# EAGLE design vco-8038 (EAGLE 7.6.0)
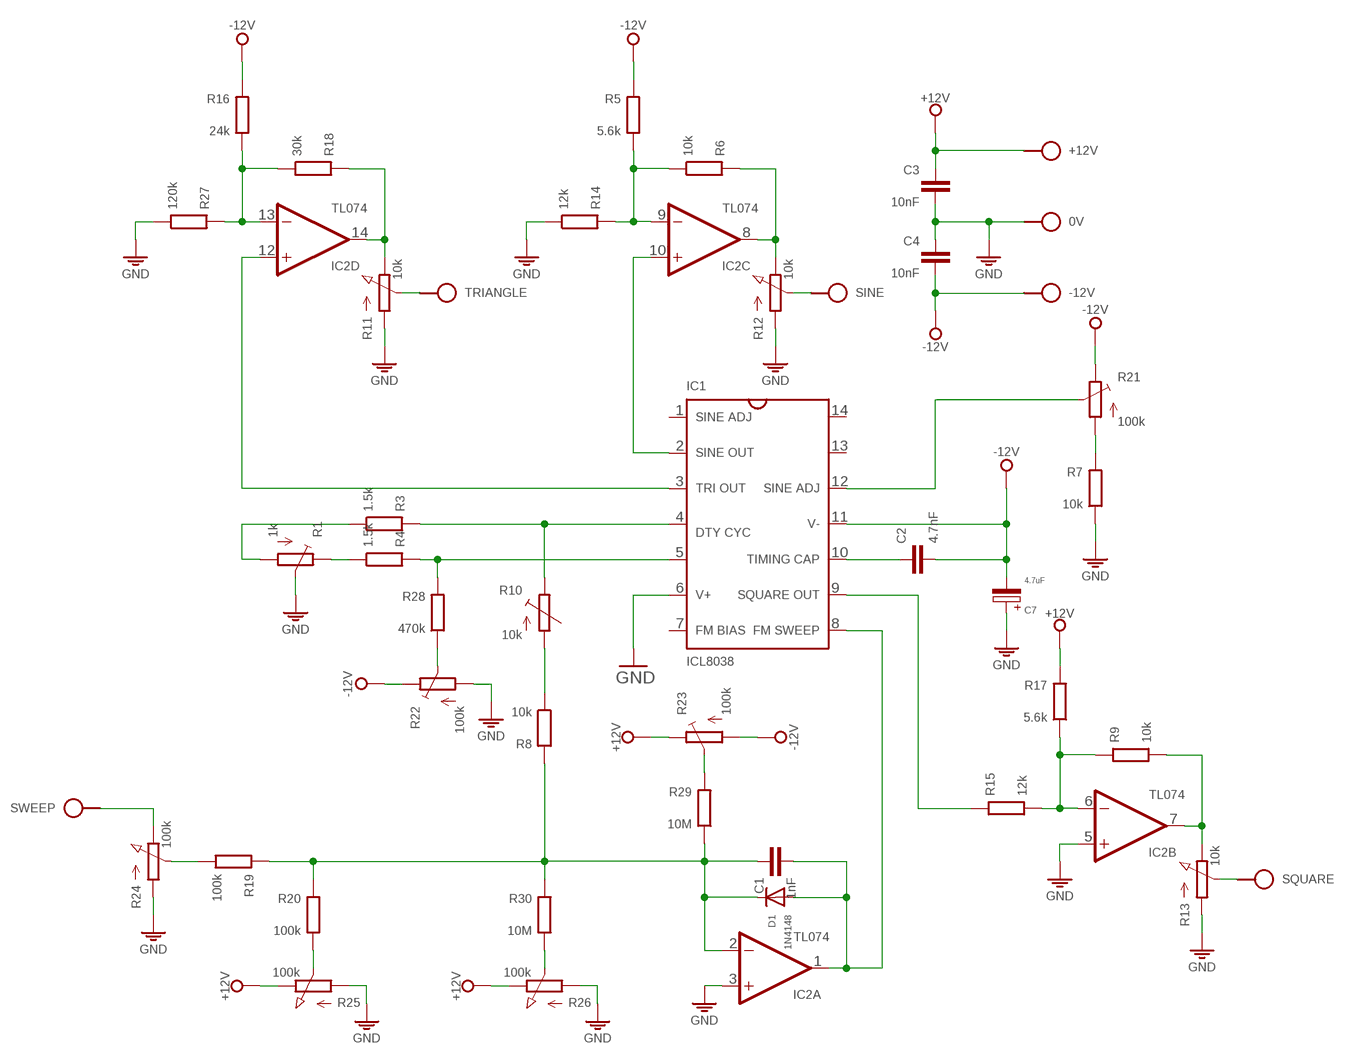
[diagram p0: schematic, sheet 1]

## Parts
0V  SPAD  [SPAD]
+12V  SPAD  [SPAD]
-12V  SPAD  [SPAD]
C1  1nF  C050-020X036  [C050-020X036]
C2  4.7nF  C050-020X036  [C050-020X036]
C3  10nF  C050-020X036  [C050-020X036]
C4  10nF  C050-020X036  [C050-020X036]
C7  4.7uF  CPOLE5-5/V  [E5-5/V]
D1  1N4148  1N414834-7  [DO34-7]
IC1  ICL8038  [DIL14]
IC2  TL074  TL074P  [DIL14]
R1  1k  TRIMR-TRIM  [R-TRIM]
R3  1.5k  R0204/7  [0204/7]
R4  1.5k  R0204/7  [0204/7]
R5  5.6k  R0204/7  [0204/7]
R6  10k  R0204/7  [0204/7]
R7  10k  R0204/7  [0204/7]
R8  10k  R0204/7  [0204/7]
R9  10k  R0204/7  [0204/7]
R10  10k  TRIM-2R-TRIM-2  [R-TRIM]
R11  10k  POT  [POT]
R12  10k  POT  [POT]
R13  10k  POT  [POT]
R14  12k  R0204/7  [0204/7]
R15  12k  R0204/7  [0204/7]
R16  24k  R0204/7  [0204/7]
R17  5.6k  R0204/7  [0204/7]
R18  30k  R0204/7  [0204/7]
R19  100k  R0204/7  [0204/7]
R20  100k  R0204/7  [0204/7]
R21  100k  TRIMR-TRIM  [R-TRIM]
R22  100k  TRIMR-TRIM  [R-TRIM]
R23  100k  TRIMR-TRIM  [R-TRIM]
R24  100k  POT  [POT]
R25  100k  POT  [POT]
R26  100k  POT  [POT]
R27  120k  R0204/7  [0204/7]
R28  470k  R0204/7  [0204/7]
R29  10M  R0204/7  [0204/7]
R30  10M  R0204/7  [0204/7]
SINE  SPAD  [SPAD]
SQUARE  SPAD  [SPAD]
SWEEP  SPAD  [SPAD]
TRIANGLE  SPAD  [SPAD]

## Nets
GND: 0V.1 C3.2 C4.1 C7.+ IC1.6(V+) IC2.3(A:+IN) IC2.5(B:+IN) R1.2(S) R7.1 R11.1(A) R12.1(A) R13.1(A) R14.1 R22.1(A) R24.1(A) R25.1(A) R26.1(A) R27.1
LF_SYMM: R22.2(S) R28.1
N$1: R23.2(S) R29.2
N$2: C1.2 D1.A IC1.8(FM_SWEEP) IC2.1(A:OUT)
N$3: C1.1 D1.C IC2.2(A:-IN) R8.2 R19.2 R20.2 R29.1 R30.2
N$4: R26.2(S) R30.1
N$5: R20.1 R25.2(S)
N$6: R19.1 R24.2(S)
N$7: R24.3(E) SWEEP.1
N$8: R8.1 R10.3
N$10: R1.1(A) R3.1
N$11: R1.3(E) R4.1
N$12: IC1.4(DUTY_1) R3.2 R10.1 R10.2
N$13: IC2.13(D:-IN) R16.1 R18.1 R27.2
N$14: IC1.5(DUTY_2) R4.2 R28.2
N$15: IC2.14(D:OUT) R11.3(E) R18.2
N$16: R11.2(S) TRIANGLE.1
N$17: IC1.3(TRI_OUT) IC2.12(D:+IN)
N$18: IC2.9(C:-IN) R5.1 R6.1 R14.2
N$19: IC2.8(C:OUT) R6.2 R12.3(E)
N$20: R12.2(S) SINE.1
N$21: IC1.2(SINE_OUT) IC2.10(C:+IN)
N$22: R7.2 R21.1(A)
N$23: IC1.12(SINE_ADJ_2) R21.2(S)
N$24: C2.1 IC1.10(TIMING_CAP)
N$25: IC2.6(B:-IN) R9.2 R15.1 R17.1
N$26: IC2.7(B:OUT) R9.1 R13.3(E)
N$27: R13.2(S) SQUARE.1
N$29: IC1.9(SQR_OUT) R15.2
V+: +12V.1 C3.1 R17.2 R23.3(E) R25.3(E) R26.3(E) ; supply symbol labelled +12V
V-: -12V.1 C2.2 C4.2 C7.- IC1.11(V-) R5.2 R16.2 R21.3(E) R22.3(E) R23.1(A) ; supply symbol labelled -12V
Unconnected: IC1.1(SINE_ADJ) IC1.7(FM_BIAS) IC1.13(NC_1) IC1.14(NC_2)

## Power pins joined to a net without a drawn wire
V+: IC2.4(P:V+)
V-: IC2.11(P:V-)

## Library data of the parts
0V +12V -12V SINE SQUARE SWEEP TRIANGLE = pad:SPAD
C1-C4 = c:C: CAPACITOR, European symbol
C7 = c:CPOL: POLARIZED CAPACITOR, European symbol
D1 = d:1N4148
IC1 = ic:ICL8038
IC2 = ic:TL074: OP AMP
R1 R21-R23 = r:TRIM: POTENTIOMETER
R3-R9 R14-R20 R27-R30 = r:R: RESISTOR, European symbol
R10 = r:TRIM-2
R11-R13 R24-R26 = r:POT

## Board
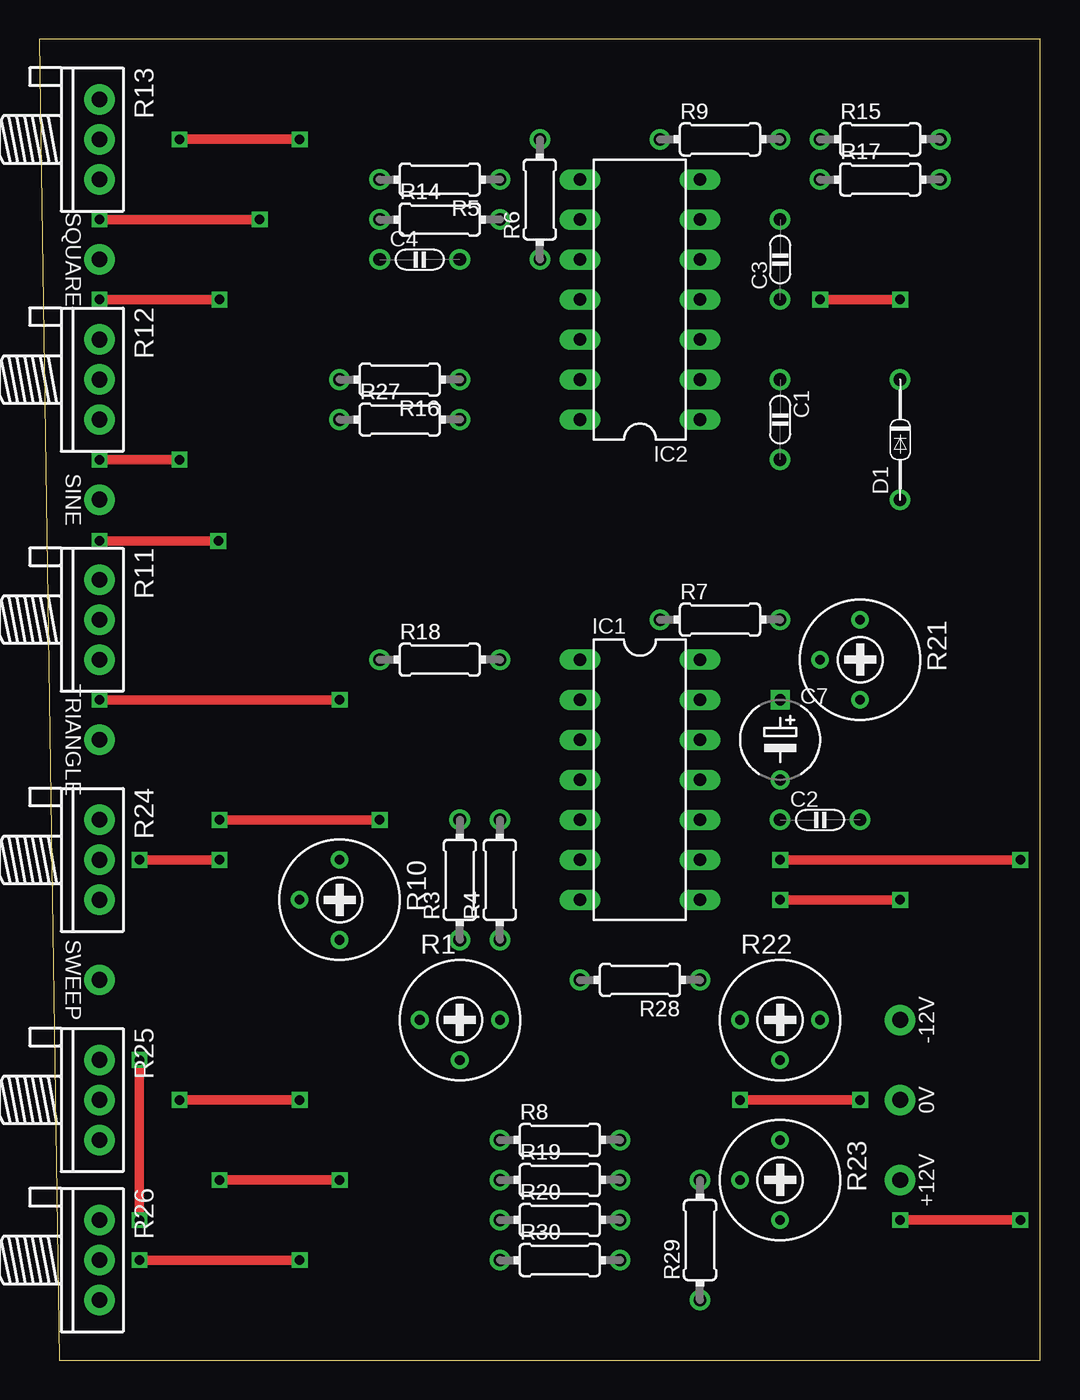
[diagram p1: board, top side]
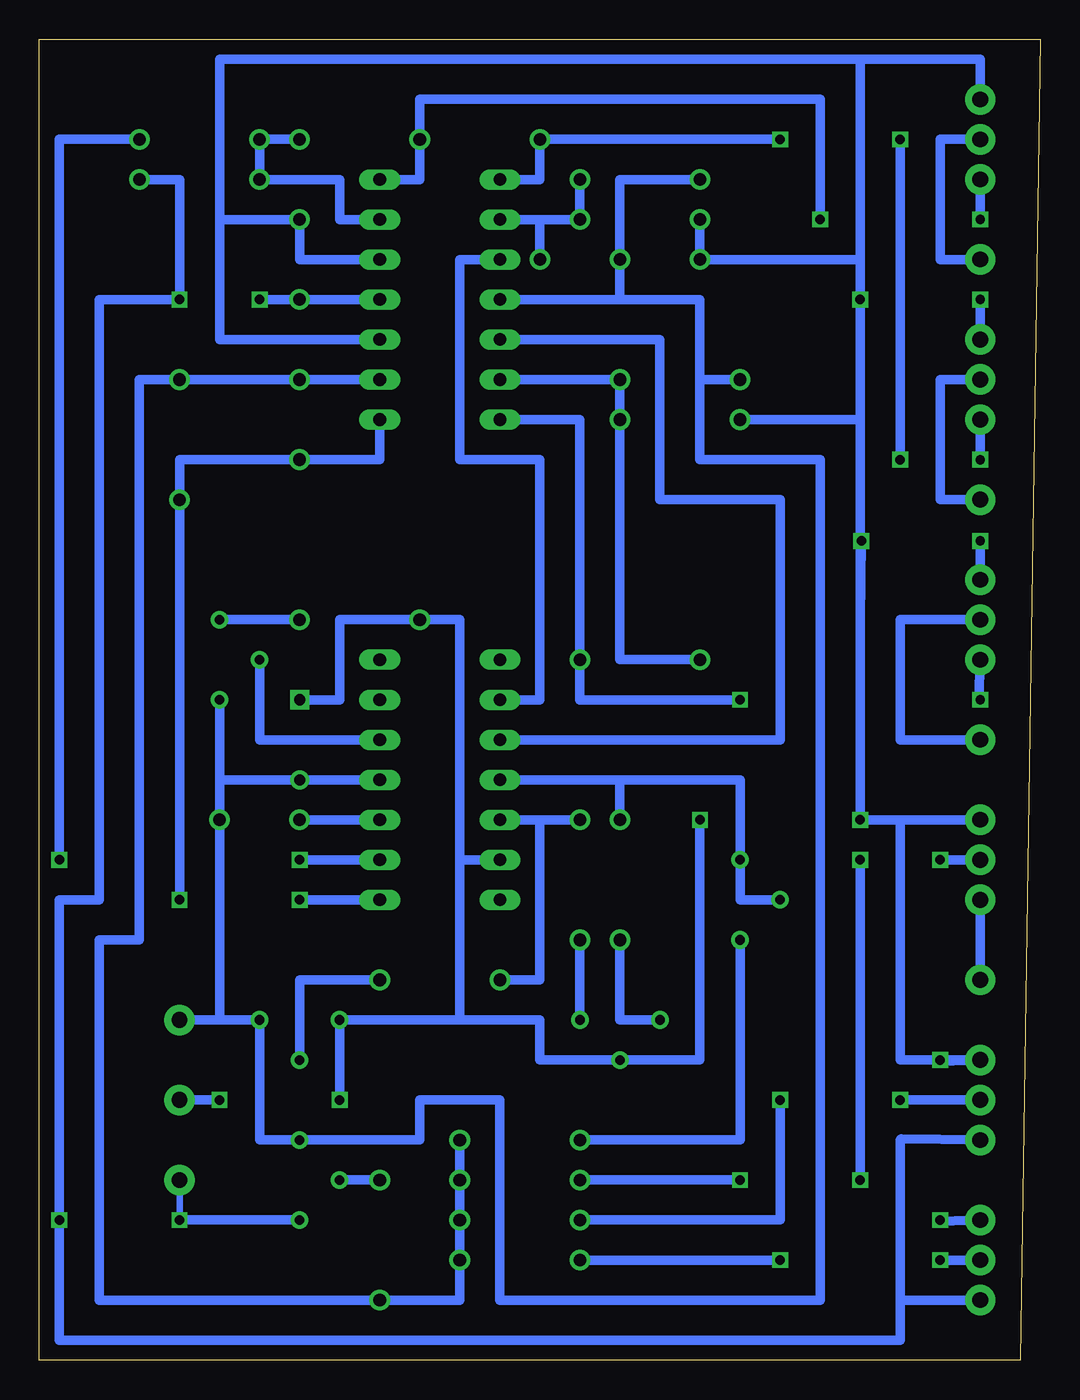
[diagram p2: board, bottom side, seen from below]

Size 63.5 x 83.82 mm. Coordinates in mm from the lower left corner, seen from the top.
Outline: 1.27,0 63.5,0 63.5,83.82 0,83.82 1.27,0
Copper layers (1*16): Top 0.035mm / dielectric 1.5mm / Bottom 0.035mm
Design rules "default": minimum track width 10mil, minimum drill 24mil, track to track 8mil, track to pad 8mil, pad to pad 8mil, via to via 8mil, smd to smd 8mil, copper to edge 40mil, drill to drill 8mil, minimum pad ring 10mil, minimum via ring 8mil, stop-mask expansion 4mil, vias tented up to drill 0mil, thermal gap 10mil

### Footprints (pad centres in the part's own frame; a part is rotated, then mirrored left to right if it is on the bottom)
SPAD = drill 1 pad 1.93: 1 0,0
C050-020X036 = drill 0.8: 1 0,-2.54; 2 0,2.54
E5-5/V = drill 0.7 square: + 0,2.54 | drill 0.7: - 0,-2.54
DO34-7 = drill 0.8: A 3.81,0; C -3.81,0
DIL14 = drill 0.8 long: 1 -3.81,7.62; 2 -3.81,5.08; 3 -3.81,2.54; 4 -3.81,0; 5 -3.81,-2.54; 6 -3.81,-5.08; 7 -3.81,-7.62; 8 3.81,-7.62; 9 3.81,-5.08; 10 3.81,-2.54; 11 3.81,0; 12 3.81,2.54; 13 3.81,5.08; 14 3.81,7.62
R-TRIM = drill 0.61: 1 -2.54,0; 2 0,-2.54; 3 2.54,0
0204/7 = drill 0.8: 1 -3.81,0; 2 3.81,0
POT = drill 1 pad 1.93: 1 -2.54,0; 2 0,0; 3 2.54,0

### Placement (x,y rotation side)
0V  54.61,16.51 180 top
+12V  54.61,11.43 180 top
-12V  54.61,21.59 180 top
C1  46.99,59.69 180 top
C2  49.53,34.29 270 top
C3  46.99,69.85 0 top
C4  24.13,69.85 270 top
C7  46.99,39.37 0 top
D1  54.61,58.42 270 top
IC1  38.1,36.83 0 top
IC2  38.1,67.31 180 top
R1  26.67,21.59 0 top
R3  26.67,30.48 90 top
R4  29.21,30.48 90 top
R5  25.4,74.93 180 top
R6  31.75,73.66 90 top
R7  43.18,46.99 0 top
R8  33.02,13.97 0 top
R9  43.18,77.47 0 top
R10  19.05,29.21 270 top
R11  3.81,46.99 270 top
R12  3.81,62.23 270 top
R13  3.81,77.47 270 top
R14  25.4,72.39 0 top
R15  53.34,77.47 0 top
R16  22.86,62.23 180 top
R17  53.34,74.93 0 top
R18  25.4,44.45 0 top
R19  33.02,11.43 0 top
R20  33.02,8.89 0 top
R21  52.07,44.45 270 top
R22  46.99,21.59 0 top
R23  46.99,11.43 270 top
R24  3.81,31.75 270 top
R25  3.81,16.51 270 top
R26  3.81,6.35 270 top
R27  22.86,59.69 0 top
R28  38.1,24.13 180 top
R29  41.91,7.62 90 top
R30  33.02,6.35 0 top
SINE  3.81,54.61 0 top
SQUARE  3.81,69.85 0 top
SWEEP  3.81,24.13 0 top
TRIANGLE  3.81,39.37 0 top

### Tracks (layer width: path | path; a pad name or v marks a point on that pad's centre or on a via)
GND  (via drill 0.6)
  Top 0.61: v21.59,34.29 v11.43,34.29 | v3.81,51.99 v11.35,51.99 | v6.35,8.89 v6.35,19.05 | v3.81,67.31 v11.43,67.31 | v52.07,16.51 v44.45,16.51
  Bottom 0.61: 36.83,31.75 IC1.6 | 36.83,31.75 36.83,21.59 | 36.83,21.59 R22.1 | 44.45,19.05 R22.1 | 52.07,72.39 C3.2 46.99,69.85 IC2.5 | 52.07,72.39 52.07,64.77 IC2.3 | 11.43,69.85 C4.1 R14.1 | 11.43,69.85 v11.43,67.31 11.43,59.69 | 11.43,59.69 R27.1 | 36.83,21.59 31.75,21.59 31.75,19.05 R1.2 21.59,19.05 v21.59,34.29 | 11.43,59.69 11.43,46.99 | 11.43,46.99 v11.43,34.29 8.89,34.29 | 36.83,31.75 36.83,46.99 R7.1 44.45,46.99 44.45,41.91 C7.+ | 52.07,72.39 52.07,82.55 11.43,82.55 | 11.43,82.55 11.43,69.85 | R11.1 v3.81,51.99 | v11.35,51.99 11.43,46.99 | R26.1 6.27,8.81 v6.35,8.89 | v6.35,19.05 R25.1 6.27,18.97 v6.35,19.05 | v6.35,19.05 8.89,19.05 8.89,34.29 | 8.89,34.29 R24.1 3.73,34.29 | R12.1 v3.81,67.31 | R13.1 3.81,82.55 11.43,82.55 | 0V.1 v52.07,16.51 | v44.45,16.51 R22.1
LF_SYMM
  Bottom 0.61: R22.2 46.99,24.13 R28.1
N$1
  Bottom 0.61: R29.2 R23.2
N$2  (via drill 0.6)
  Top 0.61: v46.99,29.21 v54.61,29.21
  Bottom 0.61: IC2.1 41.91,57.15 C1.2 54.61,57.15 D1.A v54.61,29.21 | IC1.8 v46.99,29.21
N$3
  Bottom 0.61: IC2.2 C1.1 D1.C 57.15,62.23 57.15,26.67 59.69,26.67 59.69,3.81 R29.1 36.83,3.81 R30.2 | R20.2 R19.2 R8.2 | R30.2 R20.2 | R20.2 R8.2 | R8.2 R30.2
N$4  (via drill 0.6)
  Top 0.61: v6.35,6.35 v16.51,6.35
  Bottom 0.61: R26.2 v6.35,6.35 | v16.51,6.35 R30.1
N$5  (via drill 0.6)
  Top 0.61: v16.51,16.51 v8.89,16.51
  Bottom 0.61: R20.1 16.51,8.89 v16.51,16.51 | v8.89,16.51 R25.2
N$6  (via drill 0.6)
  Top 0.61: v19.05,11.43 v11.43,11.43 | v11.43,31.75 v6.35,31.75
  Bottom 0.61: R19.1 v19.05,11.43 | v11.43,11.43 v11.43,31.75 | v6.35,31.75 R24.2
N$7
  Bottom 0.61: SWEEP.1 R24.3
N$8
  Bottom 0.61: R8.1 19.05,13.97 R10.3
N$10
  Bottom 0.61: R3.1 26.67,21.59 R1.1
N$11
  Bottom 0.61: R1.3 R4.1
N$12
  Bottom 0.61: R10.2 19.05,29.21 R10.1 19.05,36.83 26.67,36.83 | R3.2 26.67,36.83 | 26.67,36.83 IC1.4
N$13
  Bottom 0.61: R18.1 26.67,44.45 R27.2 R16.1 IC2.13
N$14
  Bottom 0.61: 31.75,34.29 IC1.5 | R28.2 31.75,24.13 31.75,34.29 | 31.75,34.29 R4.2
N$15  (via drill 0.6)
  Top 0.61: v19.05,41.91 v3.81,41.91
  Bottom 0.61: IC2.14 29.21,59.69 R18.2 29.21,41.91 v19.05,41.91 | v3.81,41.91 3.89,41.91 R11.3
N$16
  Bottom 0.61: R11.2 8.89,46.99 8.89,39.37 TRIANGLE.1
N$17
  Bottom 0.61: IC2.12 24.13,64.77 24.13,54.61 16.51,54.61 16.51,39.37 IC1.3
N$18
  Bottom 0.61: R14.2 31.75,72.39 | 31.75,72.39 IC2.9 | R14.2 R5.1 R14.2 | R14.2 30.48,72.39 31.75,72.39 | 31.75,72.39 R6.1
N$19  (via drill 0.6)
  Top 0.61: v16.51,77.47 v8.89,77.47 | v3.81,57.15 v8.89,57.15
  Bottom 0.61: IC2.8 31.75,74.93 R6.2 v16.51,77.47 | v8.89,77.47 v8.89,57.15 | R12.3 v3.81,57.15
N$20
  Bottom 0.61: SINE.1 6.35,54.61 6.35,62.23 R12.2
N$21
  Bottom 0.61: IC2.10 36.83,69.85 36.83,57.15 31.75,57.15 31.75,41.91 IC1.2
N$22
  Bottom 0.61: R21.1 R7.2
N$23
  Bottom 0.61: R21.2 49.53,39.37 IC1.12
N$24
  Bottom 0.61: IC1.10 C2.1
N$25
  Bottom 0.61: IC2.6 44.45,72.39 44.45,74.93 R17.1 R15.1 R9.2
N$26  (via drill 0.6)
  Top 0.61: v13.97,72.39 v3.81,72.39
  Bottom 0.61: IC2.7 39.37,74.93 R9.1 39.37,80.01 13.97,80.01 v13.97,72.39 | v3.81,72.39 R13.3
N$27
  Bottom 0.61: SQUARE.1 6.35,69.85 6.35,77.47 R13.2
N$29  (via drill 0.6)
  Top 0.61: v46.99,31.75 v62.23,31.75
  Bottom 0.61: IC1.9 v46.99,31.75 | v62.23,31.75 62.23,77.47 R15.2
V+  (via drill 0.6)
  Top 0.61: v54.61,8.89 v62.23,8.89 | v54.61,67.31 v49.53,67.31
  Bottom 0.406: v54.61,8.89 +12V.1
  Bottom 0.61: R23.3 v54.61,8.89 | v49.53,67.31 C3.1 IC2.4 | R17.2 54.61,74.93 v54.61,67.31 59.69,67.31 59.69,29.21 62.23,29.21 62.23,7.62 62.23,1.27 8.89,1.27 8.89,3.81 | R25.3 8.81,14.05 8.89,13.97 8.89,3.81 | 8.89,3.81 R26.3
V-
  Bottom 0.61: R5.2 26.67,74.93 C4.2 26.67,67.31 | 52.07,36.83 C2.2 52.07,21.59 R22.3 | 52.07,36.83 C7.- IC1.11 | R22.3 49.53,13.97 R23.1 39.37,13.97 39.37,16.51 34.29,16.51 34.29,3.81 13.97,3.81 13.97,57.15 21.59,57.15 21.59,62.23 | IC2.11 26.67,67.31 | 26.67,67.31 21.59,67.31 21.59,62.23 | R16.2 21.59,62.23 | 52.07,36.83 R21.3 | -12V.1 R22.3